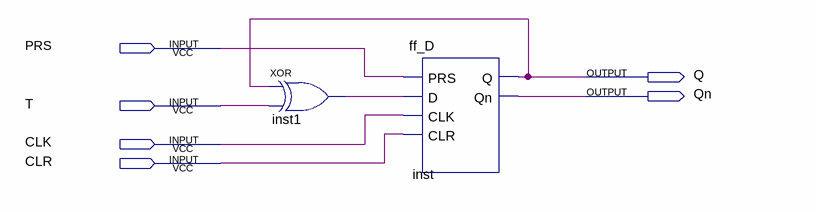
[diagram p0: schematic sheet]
// Quartus schematic ff_T.bdf as structural Verilog: 2 symbols, 6 pins
module ff_T (
  input  PRS,
  input  T,
  input  CLK,
  input  CLR,
  output Q,
  output Qn
);

  wire inst1_out;

  xor inst1 (inst1_out, Q, T);
  ff_D inst (.PRS(PRS), .D(inst1_out), .CLK(CLK), .CLR(CLR), .Q(Q), .Qn(Qn));
endmodule
